# Altium schematic sheet Capacitive_touch_activated_led.SchDoc
size A; SheetNumber: 1; SheetTotal: 1
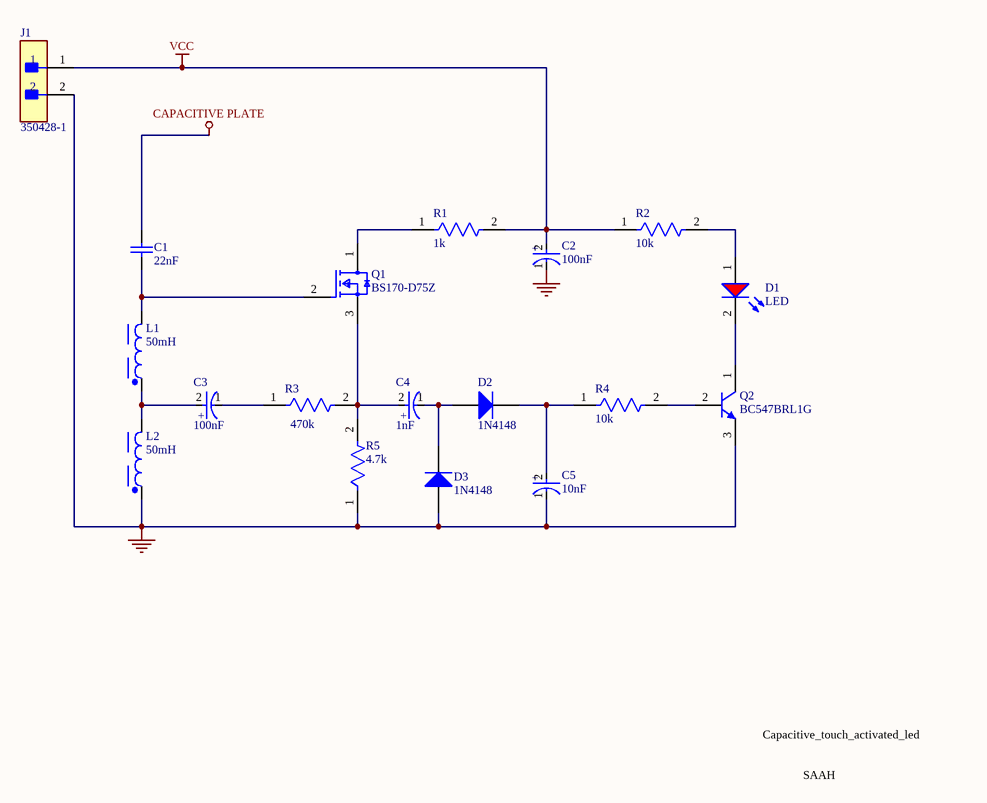
[diagram p0: Capacitive_touch_activated_led.SchDoc]

## Parts
C1  22nF  [WCAP-FTXX_L13W4.5H9.5_CS]
C2  100nF  [FP-HDF-MFG]
C3  100nF  [FP-HDF-MFG]
C4  1nF  [FP-HDF-MFG]
C5  10nF  [FP-HDF-MFG]
D1  LED  [WL-TMRC_D5.9H8.7]
D2  1N4148  [NXP-SOD27-2_V]
D3  1N4148  [NXP-SOD27-2_V]
J1  350428-1  [FP-350428-1-MFG]
L1  50mH  [WE-TI_8012]
L2  50mH  [WE-TI_8012]
Q1  BS170-D75Z  [FP-135AR-MFG]
Q2  BC547BRL1G  [ONSC-TO-92-3-29-11_AM_BL]
R1  1k  [FP-CF14-MFG]
R2  10k  [FP-CF14-MFG]
R3  470k  [FP-CF14-MFG]
R4  10k  [FP-CF14-MFG]
R5  4.7k  [FP-CF14-MFG]

## Nets
CAPACITIVE PLATE: C1.2
GND: C2.1(C) C5.1(C) D3.1(A) J1.2 L2.1 Q2.3(E) R5.1
VCC: C2.2(A) J1.1 R1.2 R2.1
NetC1_1: C1.1 L1.2 Q1.2(G)
NetC3_1: C3.1(C) R3.1
NetC3_2: C3.2(A) L1.1 L2.2
NetC4_1: C4.1(C) D2.1(A) D3.2(K)
NetC4_2: C4.2(A) Q1.3(S) R3.2 R5.2
NetC5_2: C5.2(A) D2.2(K) R4.1
NetD1_1: D1.1(A) R2.2
NetD1_2: D1.2(K) Q2.1(C)
NetQ1_1: Q1.1(D) R1.1
NetQ2_2: Q2.2(B) R4.2

## Notes on the sheet
- Capacitive_touch_activated_led
- SAAH
- (in symbol CMP-05427-000023-1) +

## Library data of the parts
C1 = CMP-03913-51400141-2: 890334023011CS WCAP-FTXX Film Capacitor 22nF 310Vac; Pin Length: 4mm; Hole Diameter: 900µm; Dielectric Material: PP; Insulation Resistance: 30GΩ; Voltage Rating (DC): 310V; Pitch: 10mm; Tolerance: 10%; Min Operating Temperature: -40°C; Max Operating Temperature: 105°C; Voltage Rating: 310V; Capacitance: 22nF; Packaging: Carton; Dielectric: PP; Case/Package: Radial; Mount: Through Hole; Height: 9.5mm; Length: 13mm; Termination: PC Pins; Width: 4.5mm; Lead Pitch: 10.0076mm; Voltage Rating (AC): 310V; Height - Seated (Max): 10.0076mm; NexarPartId: 51400141; RoHS: Compliant; REACH SVHC: Unknown
C2-C5 = CMP-05427-000023-1: CAP ALUM 10UF 20% 100V SMD; Dissipation Factor: 0.18%; Ripple Current (AC): 55mA; Impedance: 1.5R; Polarity: Polar; Leakage Current: 3uA; Life (Hours): 5000Hour; Dielectric Material: Aluminium; RoHS Compliant: Yes; Height: 10.2mm; Max Operating Temperature: 105°C; Termination: SMD/SMT; Number of Pins: 2; Lead Pitch: 3.1mm; Diameter: 8mm; Package Quantity: 1; Height - Seated (Max): 0.402inch; Radiation Hardening: No; Packaging: Tape and Reel; Construction: Cylindrical; Voltage Rating (DC): 100V; ESR (Equivalent Series Resistance): 1.5R; Voltage: 100V; Ripple Current: 55mA; Capacitance: 10uF; Mount: Surface Mount; Tolerance: 20%; Series: HD; Length: 10.2mm; Lead Free: Lead Free; Min Operating Temperature: -40°C; Voltage Rating: 100V; Case/Package: Radial; Contact Plating: Tin
D1 = CMP-03913-71241449-1: 151051SS04000 WL-TMRC THT Mono-color Round Color; Viewing Angle: 40°; Dominant Wavelength: 635nm; Forward Current: 100mA; Forward Voltage: 2.1V; Luminous Intensity: 250mcd; Max Reverse Voltage (DC): 5V; Peak Wavelength: 640nm; Height: 8.6mm; Packaging: Bulk; Mount: Through Hole; Width: 5mm; Min Operating Temperature: -40°C; Wavelength: 635nm; Max Operating Temperature: 85°C; RoHS: Compliant; Length: 5mm; NexarPartId: 71241449
D2 D3 = CMP-0648-00002-1: High-speed Diode, 100 V, 450 mA, 2-Pin SOD27, RoHS; Manufacturer: NXP Semiconductors; Configuration: Single; IR (VR: 20 V)=25 nA; IFRM: 450 mA; IFSM: 4 A Max.; Trr: 4 ns Max.; Cd: 4 pF Max.; VR: 100 V Max.; VF (IF: 10 mA)=1 V; IF: 200 mA Max.; ComponentLink1Description: Manufacturer URL; RoHS: TRUE; ComponentLink1URL: http://www.nxp.com/; ComponentLink3Description: Package Specification; DatasheetVersion: Aug-04; ComponentLink2Description: Datasheet; PackageVersion: Aug-04; PackageReference: SOD27; ComponentLink3URL: http://www.nxp.com/documents/data_sheet/1N4148_1N4448.pdf; Mounting Technology: Through Hole; ComponentLink2URL: http://www.nxp.com/documents/data_sheet/1N4148_1N4448.pdf; PartNumber: 1N4148; PackageDescription: 2-Pin Hermetically Sealed Glass Package, Axial Leaded, Dia 1.85 mm, Body Length 4.25 mm, Lead Spread 25.4 mm
J1 = CMP-03369-000080-1: CONN HEADER VERT 2POS 6.35MM; Manufacturer: TE Connectivity; Standoff Height: 0.63mm; Number Of Contacts: 2; Conn Gender: Male; Voltage Rating: 600V; Conn Orientation: Vertical; Current Rating: 12A; Number Of Rows: 1; Mouser Description: Connector, Soft Shell; Universal MATE-N-LOK; 2; Nylon; Natural; 19 A; 600 VAC; Height: 14.99mm; Pitch: 6.35mm; ComponentLink2URL: https://www.te.com/commerce/DocumentDelivery/DDEController?Action=showdoc&DocId=Customer+Drawing%7F350428%7FY2%7Fpdf%7FEnglish%7FENG_CD_350428_Y2.pdf%7F350428-1; Device Class L1: Connectors; Automotive: No; Octopart: https://octopart.com/350428-1-te+connectivity-46505355; Digikey Description: CONN HEADER VERT 2POS 6.35MM; RoHS: TRUE; Temperature: -40°C to +105°C; Contact Material: Gold,Nickel; Package: 350428-1; Temperature Range Low: -40°C; Device Class L3: unset; Lead Free: Yes; Device Class L2: Headers and Wire Housings; Category: Conn; ComponentLink2Description: Datasheet; Temperature Range High: +105°C; Manufacturer Part Number: 350428-1
L1 L2 = CMP-1405-00015-3: NexarPartId: 24533258; Inductance: 68mH; DC Resistance (DCR): 90Ω; Current Rating: 50mA; Self Resonant Frequency: 160kHz; Inductance Tolerance: 5%; Height: 13.5mm; Width: 9.5mm; Number of Pins: 2; Max Operating Temperature: 125°C; Length: 9.5mm; Packaging: Bulk; RoHS: Compliant; Ambient Temperature Range Low: -40°C; Ambient Temperature Range High: 85°C; Min Operating Temperature: -40°C
Q1 = CMP-00278-84793704-1: BS170-D75Z BS170 Series 60 V 5 Ohm N-Channel Enhancement Mode Field Effect Transistor-TO-92; Manufacturer Lifecycle Status: ACTIVE; Gate to Source Voltage (Vgs): 20V; Continuous Drain Current (ID): 500mA; Turn-Off Delay Time: 10ns; Power Dissipation: 830mW; Drain to Source Resistance: 1.2Ω; Max Junction Temperature (Tj): 150°C; Number of Channels: 1; Drain to Source Voltage (Vdss): 60V; Schedule B: 8541210080, 8541210080; Min Operating Temperature: -55°C; NexarPartId: 84793704; RoHS: Compliant; Lifecycle Status: Production; Height: 8.77mm; Max Operating Temperature: 150°C; Turn-On Delay Time: 10ns; Drain to Source Breakdown Voltage: 60V
Q2 = CMP-1048-01605-1: Amplifier Transistor, NPN Silicon, 3-Pin TO-92, Pb-Free, Tape and Reel; Manufacturer: On Semiconductor; IC Continuous (A): 0.1; fT Min (MHz): 150; ComponentLink2URL: http://www.onsemi.com/pub_link/Collateral/BC546-D.PDF; ComponentLink1URL: http://www.onsemi.com/; ComponentLink2Description: Datasheet; RoHS: TRUE; ComponentLink3Description: Package Specification; ComponentLink1Description: Manufacturer URL; ComponentLink3URL: http://www.onsemi.com/pub_link/Collateral/MAC97-D.PDF; PackageDescription: 3-Pin Transistor Outline, Body 4.825 x 3.685 mm, Pitch 1.27 mm; Packing: Tape and Reel; PackageVersion: Rev. AM; Polarity: NPN; DatasheetVersion: Rev. 7; Mounting Technology: Through Hole; PackageReference: TO-92-3-29-11_AM_BL; PartNumber: BC547BRL1G
R1-R5 = CMP-26528-000003-1: RES 7.5K OHM 1/4W 5% AXIAL; Max Power Dissipation: 250mW; Temperature Coefficient: -400ppm/°C; Resistance: 7.5kR; RoHS Compliant: Yes; Lead Free: Lead Free; Max Operating Temperature: 155°C; Case/Package: Axial; Tolerance: 5%; Power Rating: 250mW; Diameter: 2.3mm; Features: Flame Retardant Coating; Series: CF; Resistor Type: Carbon Film; Number of Terminations: 2; Length: 0.256inch; Min Operating Temperature: -55°C; Contact Plating: Tin; Packaging: Tape and Reel; Mount: Through Hole; Radiation Hardening: No